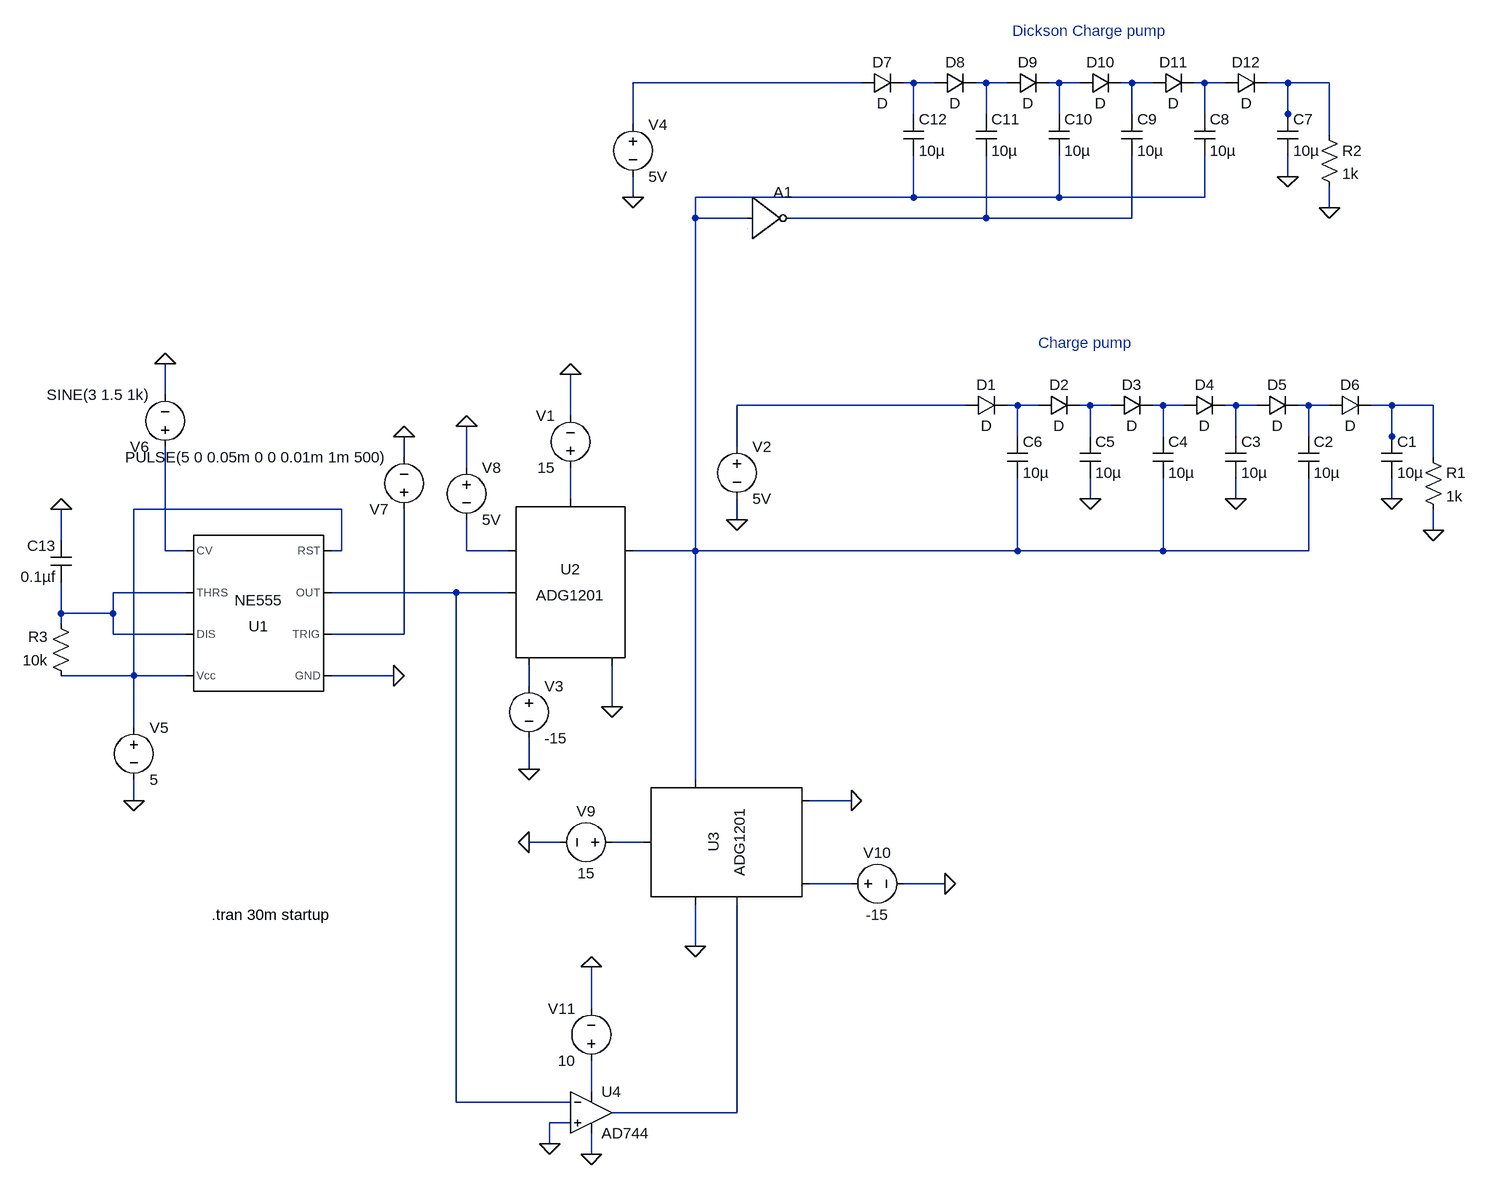
[diagram p0: schematic Charge Pump Debugging With PWM.asc]
Charge Pump Debugging With PWM.asc, the LTspice schematic file:
Version 4
SHEET 1 880 1268
WIRE -240 -400 -592 -400
WIRE -160 -400 -176 -400
WIRE -128 -400 -160 -400
WIRE -48 -400 -64 -400
WIRE -16 -400 -48 -400
WIRE 64 -400 48 -400
WIRE 96 -400 64 -400
WIRE 176 -400 160 -400
WIRE 208 -400 176 -400
WIRE 288 -400 272 -400
WIRE 320 -400 288 -400
WIRE 416 -400 384 -400
WIRE 480 -400 416 -400
WIRE -160 -352 -160 -400
WIRE -48 -352 -48 -400
WIRE 64 -352 64 -400
WIRE 176 -352 176 -400
WIRE 288 -352 288 -400
WIRE 416 -352 416 -400
WIRE -592 -336 -592 -400
WIRE 416 -336 416 -352
WIRE 480 -320 480 -400
WIRE 416 -256 416 -288
WIRE -592 -224 -592 -256
WIRE -160 -224 -160 -288
WIRE -160 -224 -496 -224
WIRE 64 -224 64 -288
WIRE 64 -224 -160 -224
WIRE 288 -224 288 -288
WIRE 288 -224 64 -224
WIRE 480 -208 480 -240
WIRE -496 -192 -496 -224
WIRE -416 -192 -496 -192
WIRE -48 -192 -48 -288
WIRE -48 -192 -352 -192
WIRE 176 -192 176 -288
WIRE 176 -192 -48 -192
WIRE -1312 80 -1312 32
WIRE -80 96 -432 96
WIRE 0 96 -16 96
WIRE 32 96 0 96
WIRE 112 96 96 96
WIRE 144 96 112 96
WIRE 224 96 208 96
WIRE 256 96 224 96
WIRE 336 96 320 96
WIRE 368 96 336 96
WIRE 448 96 432 96
WIRE 480 96 448 96
WIRE 576 96 544 96
WIRE 640 96 576 96
WIRE -688 112 -688 48
WIRE 0 144 0 96
WIRE 112 144 112 96
WIRE 224 144 224 96
WIRE 336 144 336 96
WIRE 448 144 448 96
WIRE 576 144 576 96
WIRE -432 160 -432 96
WIRE 576 160 576 144
WIRE -944 176 -944 144
WIRE 640 176 640 96
WIRE -848 192 -848 128
WIRE -688 240 -688 192
WIRE 112 240 112 208
WIRE 336 240 336 208
WIRE 576 240 576 208
WIRE -1040 256 -1360 256
WIRE -432 272 -432 240
WIRE 640 288 640 256
WIRE -1472 304 -1472 256
WIRE -1312 320 -1312 160
WIRE -1280 320 -1312 320
WIRE -1040 320 -1040 256
WIRE -1040 320 -1056 320
WIRE -848 320 -848 272
WIRE -784 320 -848 320
WIRE -496 320 -496 -192
WIRE -496 320 -592 320
WIRE 0 320 0 208
WIRE 0 320 -496 320
WIRE 224 320 224 208
WIRE 224 320 0 320
WIRE 448 320 448 208
WIRE 448 320 224 320
WIRE -1280 384 -1392 384
WIRE -864 384 -1056 384
WIRE -784 384 -864 384
WIRE -1472 416 -1472 368
WIRE -1392 416 -1392 384
WIRE -1392 416 -1472 416
WIRE -1472 432 -1472 416
WIRE -1392 448 -1392 416
WIRE -1280 448 -1392 448
WIRE -944 448 -944 256
WIRE -944 448 -1056 448
WIRE -1360 512 -1360 256
WIRE -1360 512 -1472 512
WIRE -1280 512 -1360 512
WIRE -960 512 -1056 512
WIRE -752 528 -752 496
WIRE -624 560 -624 496
WIRE -1360 592 -1360 512
WIRE -752 656 -752 608
WIRE -496 672 -496 320
WIRE -1360 704 -1360 672
WIRE -256 704 -320 704
WIRE -704 768 -752 768
WIRE -576 768 -624 768
WIRE -256 832 -320 832
WIRE -112 832 -176 832
WIRE -496 928 -496 864
WIRE -656 1024 -656 960
WIRE -656 1152 -656 1104
WIRE -864 1168 -864 384
WIRE -688 1168 -864 1168
WIRE -432 1184 -432 864
WIRE -432 1184 -624 1184
WIRE -688 1200 -720 1200
WIRE -720 1232 -720 1200
WIRE -656 1248 -656 1216
FLAG 640 288 0
FLAG 576 240 0
FLAG 112 240 0
FLAG 336 240 0
FLAG -432 272 0
FLAG 480 -208 0
FLAG 416 -256 0
FLAG -592 -224 0
FLAG -960 512 0
FLAG -1360 704 0
FLAG -1312 32 0
FLAG -1472 256 0
FLAG -944 144 0
FLAG -624 560 0
FLAG -752 656 0
FLAG -688 48 0
FLAG -848 128 0
FLAG -496 928 0
FLAG -256 704 0
FLAG -112 832 0
FLAG -752 768 0
FLAG -720 1232 0
FLAG -656 1248 0
FLAG -656 960 0
SYMBOL diode -80 112 R270
WINDOW 0 32 32 VTop 2
WINDOW 3 0 32 VBottom 2
SYMATTR InstName D1
SYMBOL diode 32 112 R270
WINDOW 0 32 32 VTop 2
WINDOW 3 0 32 VBottom 2
SYMATTR InstName D2
SYMBOL diode 144 112 R270
WINDOW 0 32 32 VTop 2
WINDOW 3 0 32 VBottom 2
SYMATTR InstName D3
SYMBOL diode 256 112 R270
WINDOW 0 32 32 VTop 2
WINDOW 3 0 32 VBottom 2
SYMATTR InstName D4
SYMBOL diode 368 112 R270
WINDOW 0 32 32 VTop 2
WINDOW 3 0 32 VBottom 2
SYMATTR InstName D5
SYMBOL diode 480 112 R270
WINDOW 0 32 32 VTop 2
WINDOW 3 0 32 VBottom 2
SYMATTR InstName D6
SYMBOL res 624 160 R0
SYMATTR InstName R1
SYMATTR Value 1k
SYMBOL cap 560 144 R0
SYMATTR InstName C1
SYMATTR Value 10µ
SYMBOL cap 432 144 R0
SYMATTR InstName C2
SYMATTR Value 10µ
SYMBOL cap 320 144 R0
SYMATTR InstName C3
SYMATTR Value 10µ
SYMBOL cap 208 144 R0
SYMATTR InstName C4
SYMATTR Value 10µ
SYMBOL cap 96 144 R0
SYMATTR InstName C5
SYMATTR Value 10µ
SYMBOL cap -16 144 R0
SYMATTR InstName C6
SYMATTR Value 10µ
SYMBOL voltage -432 144 R0
SYMATTR InstName V2
SYMATTR Value 5V
SYMBOL diode -240 -384 R270
WINDOW 0 32 32 VTop 2
WINDOW 3 0 32 VBottom 2
SYMATTR InstName D7
SYMBOL diode -128 -384 R270
WINDOW 0 32 32 VTop 2
WINDOW 3 0 32 VBottom 2
SYMATTR InstName D8
SYMBOL diode -16 -384 R270
WINDOW 0 32 32 VTop 2
WINDOW 3 0 32 VBottom 2
SYMATTR InstName D9
SYMBOL diode 96 -384 R270
WINDOW 0 32 32 VTop 2
WINDOW 3 0 32 VBottom 2
SYMATTR InstName D10
SYMBOL diode 208 -384 R270
WINDOW 0 32 32 VTop 2
WINDOW 3 0 32 VBottom 2
SYMATTR InstName D11
SYMBOL diode 320 -384 R270
WINDOW 0 32 32 VTop 2
WINDOW 3 0 32 VBottom 2
SYMATTR InstName D12
SYMBOL res 464 -336 R0
SYMATTR InstName R2
SYMATTR Value 1k
SYMBOL cap 400 -352 R0
SYMATTR InstName C7
SYMATTR Value 10µ
SYMBOL cap 272 -352 R0
SYMATTR InstName C8
SYMATTR Value 10µ
SYMBOL cap 160 -352 R0
SYMATTR InstName C9
SYMATTR Value 10µ
SYMBOL cap 48 -352 R0
SYMATTR InstName C10
SYMATTR Value 10µ
SYMBOL cap -64 -352 R0
SYMATTR InstName C11
SYMATTR Value 10µ
SYMBOL cap -176 -352 R0
SYMATTR InstName C12
SYMATTR Value 10µ
SYMBOL voltage -592 -352 R0
SYMATTR InstName V4
SYMATTR Value 5V
SYMBOL Digital\\inv -416 -256 R0
SYMATTR InstName A1
SYMBOL Misc\\NE555 -1168 416 R180
SYMATTR InstName U1
SYMBOL voltage -1360 576 R0
SYMATTR InstName V5
SYMATTR Value 5
SYMBOL voltage -1312 176 R180
WINDOW 123 0 0 Left 0
WINDOW 39 0 0 Left 0
SYMATTR InstName V6
SYMATTR Value SINE(3 1.5 1k)
SYMBOL cap -1456 368 R180
WINDOW 0 24 56 Left 2
WINDOW 3 24 8 Left 2
SYMATTR InstName C13
SYMATTR Value 0.1µf
SYMBOL res -1456 528 R180
WINDOW 0 36 76 Left 2
WINDOW 3 36 40 Left 2
SYMATTR InstName R3
SYMATTR Value 10k
SYMBOL voltage -944 272 R180
WINDOW 123 0 0 Left 0
WINDOW 39 0 0 Left 0
SYMATTR InstName V7
SYMATTR Value PULSE(5 0 0.05m 0 0 0.01m 1m 500)
SYMBOL Switches\\ADG1201 -688 368 R0
SYMATTR InstName U2
SYMBOL voltage -688 208 R180
WINDOW 0 24 96 Left 2
WINDOW 3 24 16 Left 2
SYMATTR InstName V1
SYMATTR Value 15
SYMBOL voltage -752 512 R0
SYMATTR InstName V3
SYMATTR Value -15
SYMBOL voltage -848 176 R0
WINDOW 123 0 0 Left 0
WINDOW 39 0 0 Left 0
SYMATTR InstName V8
SYMATTR Value 5V
SYMBOL Switches\\ADG1201 -448 768 R270
SYMATTR InstName U3
SYMBOL voltage -608 768 R90
WINDOW 0 -32 56 VBottom 2
WINDOW 3 32 56 VTop 2
SYMATTR InstName V9
SYMATTR Value 15
SYMBOL voltage -272 832 R270
WINDOW 0 32 56 VTop 2
WINDOW 3 -32 56 VBottom 2
SYMATTR InstName V10
SYMATTR Value -15
SYMBOL OpAmps\\AD744 -656 1120 R0
SYMATTR InstName U4
SYMBOL voltage -656 1120 R180
WINDOW 0 24 96 Left 2
WINDOW 3 24 16 Left 2
WINDOW 123 0 0 Left 0
WINDOW 39 0 0 Left 0
SYMATTR InstName V11
SYMATTR Value 10
TEXT 32 0 Left 2 ;Charge pump
TEXT -1240 880 Left 2 !.tran 30m startup
TEXT -8 -480 Left 2 ;Dickson Charge pump

The netlist it stands for:
* Charge Pump Debugging With PWM.asc
D1 N010 N011 D
D2 N011 N012 D
D3 N012 N013 D
D4 N013 N014 D
D5 N014 N015 D
D6 N015 N016 D
R1 N016 0 1k
C1 N016 0 10µ
C2 N015 N008 10µ
C3 N014 0 10µ
C4 N013 N008 10µ
C5 N012 0 10µ
C6 N011 N008 10µ
V2 N010 0 5V
D7 N001 N002 D
D8 N002 N003 D
D9 N003 N004 D
D10 N004 N005 D
D11 N005 N006 D
D12 N006 N007 D
R2 N007 0 1k
C7 N007 0 10µ
C8 N006 N008 10µ
C9 N005 N009 10µ
C10 N004 N008 10µ
C11 N003 N009 10µ
C12 N002 N008 10µ
V4 N001 0 5V
A1 N008 0 0 0 0 N009 0 0 BUF
XU1 0 N023 N022 N018 N019 N021 N021 N018 NE555  ; pins GND TRIG OUT RST CV THRS DIS Vcc
V5 N018 0 5
V6 N019 0 SINE(3 1.5 1k)
C13 N021 0 0.1µf
R3 N018 N021 10k
V7 N023 0 PULSE(5 0 0.05m 0 0 0.01m 1m 500)
XU2 N022 N008 N020 N024 0 N017 ADG1201
V1 N017 0 15
V3 N024 0 -15
V8 0 N020 5V
XU3 N028 N008 0 N026 0 N025 ADG1201
V9 N025 0 15
V10 N026 0 -15
XU4 0 N022 N027 0 N028 AD744  ; pins In+ In- V+ V- OUT
V11 N027 0 10
.model D D
.lib standard.dio
* Charge pump
.tran 30m startup
* Dickson Charge pump
.lib NE555.sub
.lib ADG1201.sub
.backanno
.end